# EAGLE design lcmeter (EAGLE 6.4)
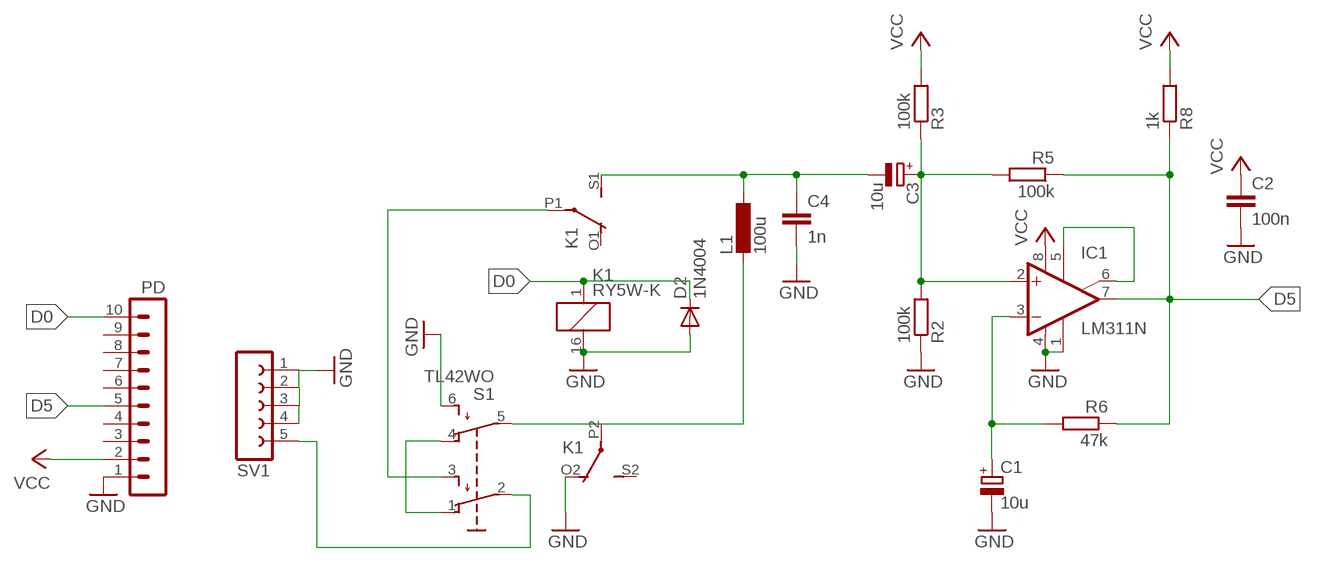
[diagram p0: schematic, sheet 1]

## Parts
C1  10u  CPOL-EUE2.5-6  [E2,5-6]
C2  100n  C-EU025-024X044  [C025-024X044]
C3  10u  CPOL-EUTT5D7  [TT5D7]
C4  1n  C-EU050-025X075  [C050-025X075]
D2  1N4004  1N4148DO35-7  [DO35-7]
IC1  LM311N  [DIL08]
K1  RY5W-K  351  [351]
L1  100u  L-EU0204/7  [0204/7]
PD  MA10-1W  [MA10-1W]
R2  100k  R-EU_0207/10  [0207/10]
R3  100k  R-EU_0204/7  [0204/7]
R5  100k  R-EU_0204/7  [0204/7]
R6  47k  R-EU_0204/5  [0204/5]
R8  1k  R-EU_0204/7  [0204/7]
S1  TL42WO  [TL4XWO]
SV1  FE05W  [FE05W]

## Nets
D0: D2.C K1.1 PD.10
D5: IC1.7(OUT) PD.5 R5.1 R6.1 R8.1
GND: C1.- C2.2 C4.2 D2.A IC1.1(GND) IC1.4(V-) K1.16 K1.O2(3:O) PD.1 R2.1 S1.6(S1) SV1.1 SV1.2 SV1.3 SV1.4
N$2: IC1.5(ON) IC1.6(ON/STR)
N$4: C3.+ IC1.2(+IN) R2.2 R3.1 R5.2
N$5: C1.+ IC1.3(-IN) R6.2
N$7: S1.1(O) S1.4(O1)
N$9: K1.P2(3:P) L1.2 S1.5(P1)
N$10: C3.- C4.1 K1.S1(2:S) L1.1
N$12: S1.2(P) SV1.5
N$13: K1.P1(2:P) S1.3(S)
VCC: C2.1 IC1.8(V+) PD.2 R3.2 R8.2
Unconnected: K1.O1(2:O) K1.S2(3:S) PD.3 PD.4 PD.6 PD.7 PD.8 PD.9

## Library data of the parts
C1 C3 = rcl:CPOL-EU: POLARIZED CAPACITOR, European symbol
C2 C4 = rcl:C-EU: CAPACITOR, European symbol
D2 = diode:1N4148: DIODE high speed (Philips)
IC1 = linear:LM311: COMPARATOR
K1 = relay:351: RELAY 2 x switch, Omron; OC_FARNELL: unknown; OC_NEWARK: unknown
L1 = rcl:L-EU: INDUCTOR, European symbol
PD = con-lstb:MA10-1W: PIN HEADER
R2 R3 R5 R6 R8 = rcl:R-EU_: RESISTOR, European symbol
S1 = switch:TL42WO: TINY SWITCH ON - MOM Source: http://www2.produktinfo.conrad.com/datenblaetter/700000-724999/705152-da-01-de-Subminiaturschalter_TL_36WO.pdf
SV1 = con-lsta:FE05W: FEMALE HEADER; OC_FARNELL: unknown; OC_NEWARK: unknown

## Board
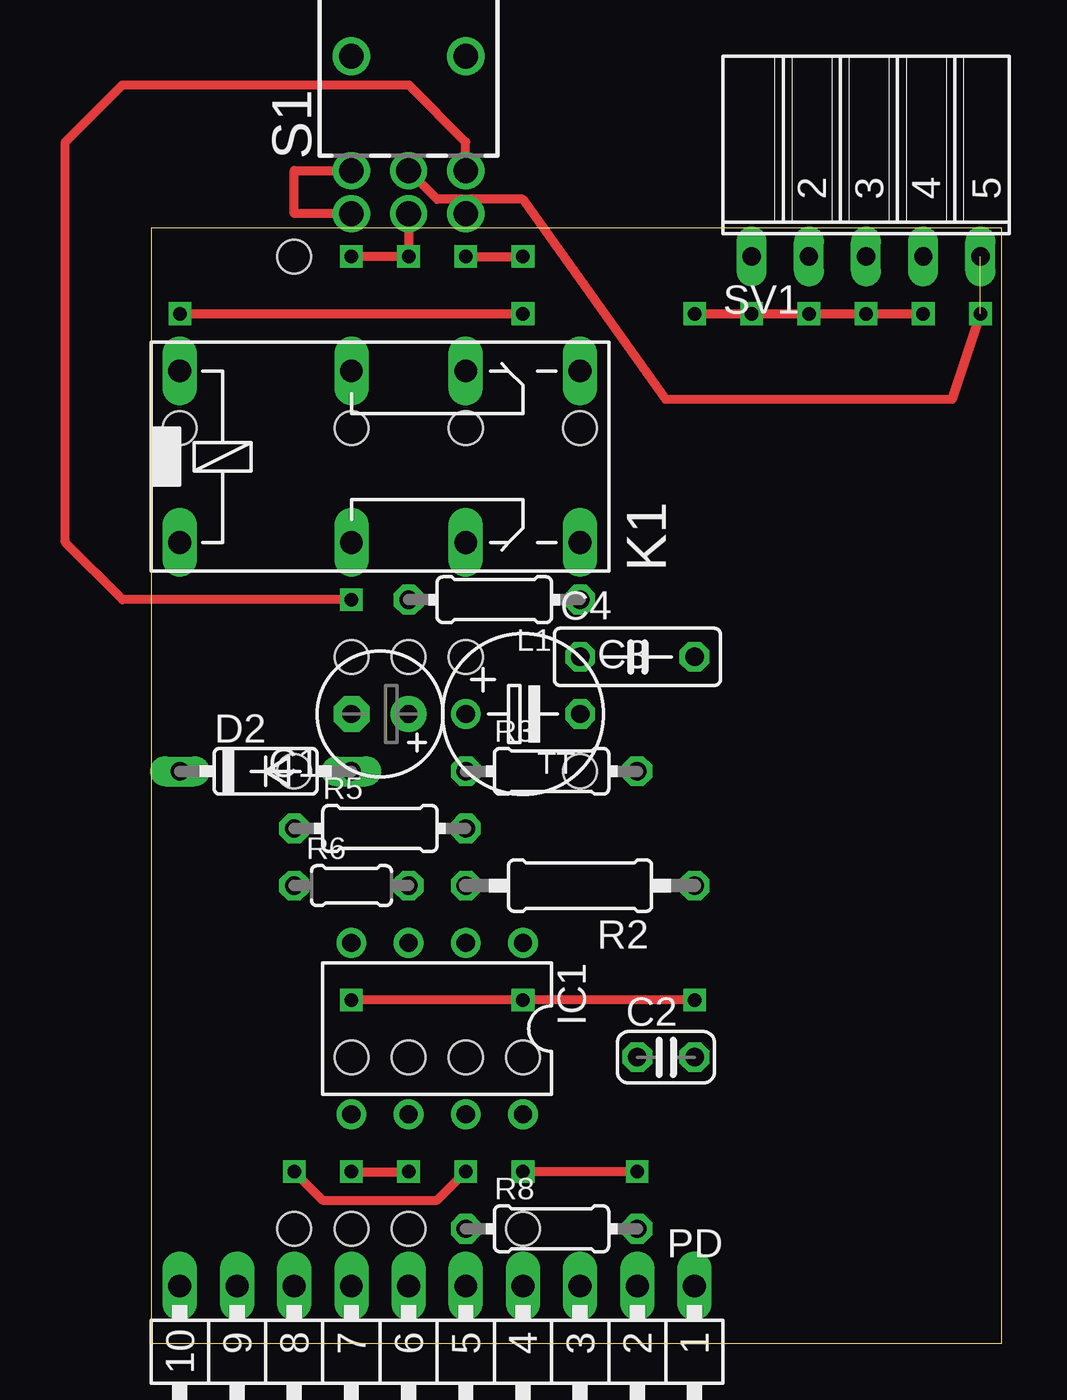
[diagram p1: board, top side]
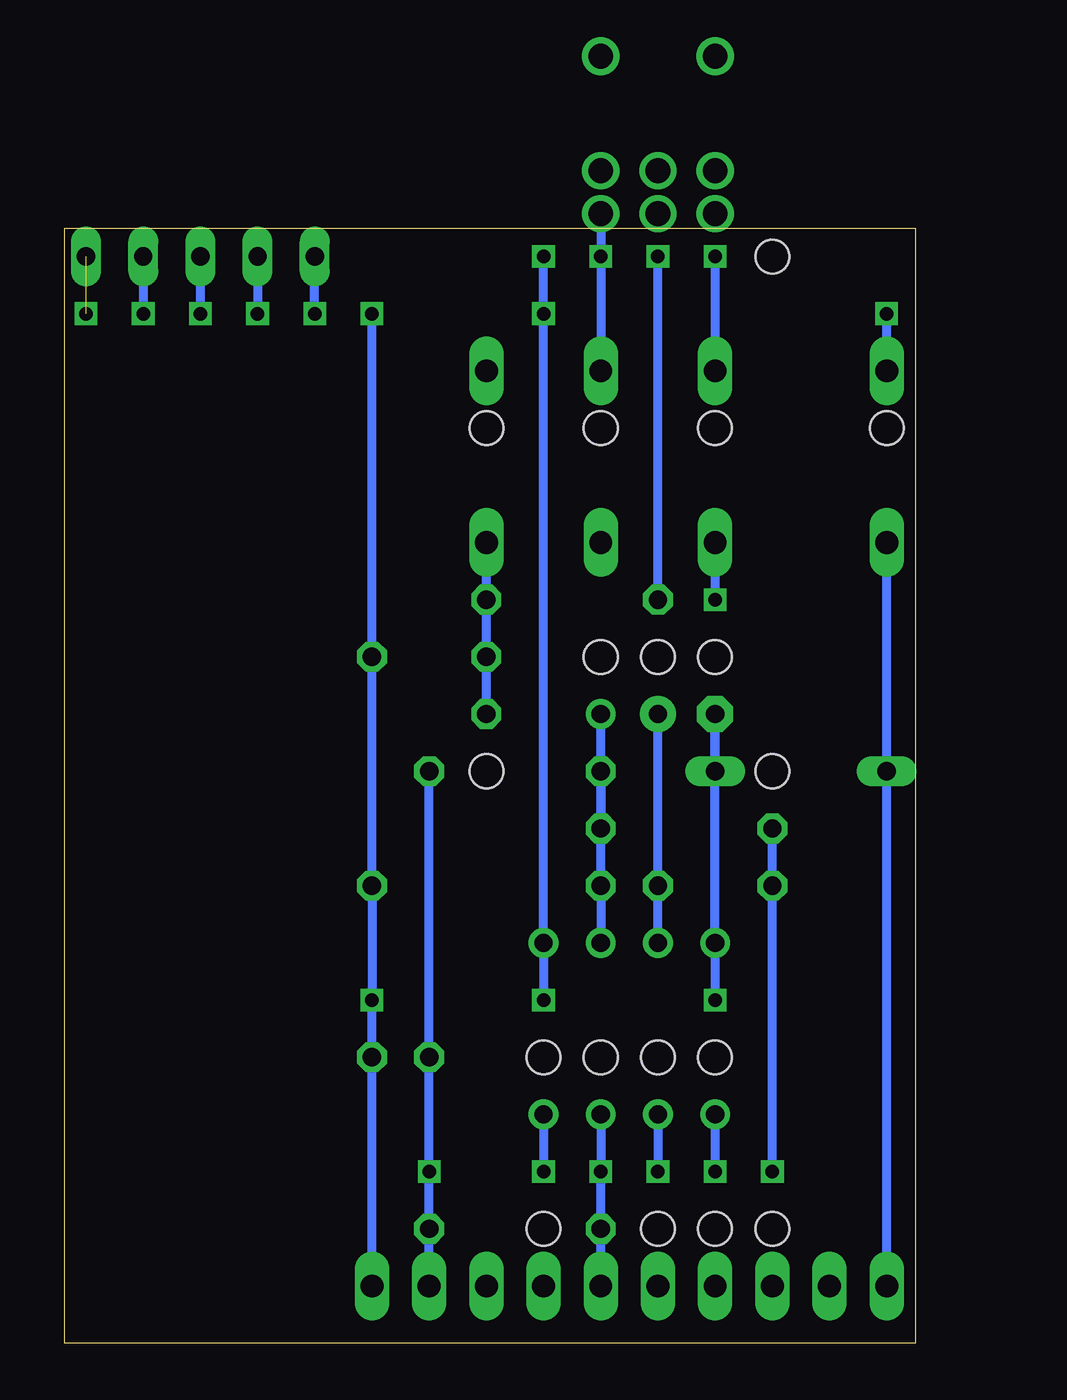
[diagram p2: board, bottom side, seen from below]

Size 37.77 x 49.52 mm. Coordinates in mm from the lower left corner, seen from the top.
Outline: 0,0 37.77,0 37.77,49.52 0,49.52 0,0
Copper layers (1*16): Top 0.035mm / dielectric 1.5mm / Bottom 0.035mm
Design rules "default": minimum track width 10mil, minimum drill 24mil, track to track 8mil, track to pad 8mil, pad to pad 8mil, via to via 8mil, smd to smd 8mil, copper to edge 40mil, drill to drill 8mil, minimum pad ring 10mil, minimum via ring 8mil, stop-mask expansion 4mil, vias tented up to drill 0mil, thermal gap 10mil
Holes 1.5 mm at 6.35,5.08 8.89,5.08 11.43,5.08 19.05,40.64 13.97,40.64 8.89,40.64 1.27,40.64 16.51,5.08 8.89,12.7 11.43,12.7 13.97,12.7 16.51,12.7 19.05,25.4 11.43,30.48 8.89,30.48 6.35,25.4 13.97,30.48 6.35,48.26

### Footprints (pad centres in the part's own frame; a part is rotated, then mirrored left to right if it is on the bottom)
E2,5-6 = drill 0.813 pad 1.6: + -1.27,0 | drill 0.813 pad 1.6 octagon: - 1.27,0
C025-024X044 = drill 0.813 octagon: 1 -1.27,0; 2 1.27,0
TT5D7 = drill 0.813: + -2.54,0 | drill 0.813 octagon: - 2.54,0
C050-025X075 = drill 0.813 octagon: 1 -2.54,0; 2 2.54,0
DO35-7 = drill 0.813 long: A 3.81,0; C -3.81,0
DIL08 = drill 0.813 pad 1.27: 1 -3.81,-3.81; 2 -1.27,-3.81; 3 1.27,-3.81; 4 3.81,-3.81; 5 3.81,3.81; 6 1.27,3.81; 7 -1.27,3.81; 8 -3.81,3.81
351 = drill 1.016 long: 1 -3.81,-3.81; 16 -3.81,3.81; O1 8.89,-3.81; O2 8.89,3.81; P1 3.81,-3.81; P2 3.81,3.81; S1 13.97,-3.81; S2 13.97,3.81
0204/7 = drill 0.813 octagon: 1 -3.81,0; 2 3.81,0
MA10-1W = drill 1.016 long: 1 -11.43,0; 2 -8.89,0; 3 -6.35,0; 4 -3.81,0; 5 -1.27,0; 6 1.27,0; 7 3.81,0; 8 6.35,0; 9 8.89,0; 10 11.43,0
0207/10 = drill 0.813 octagon: 1 -5.08,0; 2 5.08,0
0204/5 = drill 0.813 octagon: 1 -2.54,0; 2 2.54,0
TL4XWO = drill 1.1 pad 1.422: 1 -2.54,-5.08; 2 0,-5.08; 3 2.54,-5.08; 4 -2.54,-6.985; 5 0,-6.985; 6 2.54,-6.985 | drill 1.1 pad 1.676: M1 -2.54,0; M2 2.54,0
FE05W = drill 0.813 long: 1 -5.08,0; 2 -2.54,0; 3 0,0; 4 2.54,0; 5 5.08,0

### Placement (x,y rotation side)
C1  10.16,27.94 180 top
C2  22.86,12.7 0 top
C3  16.51,27.94 0 top
C4  21.59,30.48 0 top
D2  5.08,25.4 0 top
IC1  12.7,13.97 180 top
K1  5.08,39.37 0 top
L1  15.24,33.02 180 top
PD  12.7,2.54 180 top
R2  19.05,20.32 180 top
R3  17.78,25.4 0 top
R5  10.16,22.86 0 top
R6  8.89,20.32 0 top
R8  17.78,5.08 0 top
S1  11.43,57.15 0 top
SV1  31.75,48.26 0 top

### Tracks (layer width: path | path; a pad name or v marks a point on that pad's centre or on a via)
D0
  Bottom 0.406: PD.10 D2.C K1.1
D5  (via drill 0.6)
  Top 0.406: v6.35,7.62 7.62,6.35 12.7,6.35 v13.97,7.62
  Bottom 0.406: IC1.7 v13.97,7.62 R8.1 PD.5 | v6.35,7.62 R6.1 R5.1
GND  (via drill 0.6)
  Top 0.406: v24.13,15.24 v16.51,15.24 v8.89,15.24 | v13.97,48.26 v16.51,48.26 | v1.27,45.72 v16.51,45.72 | v24.13,45.72 v26.67,45.72 v29.21,45.72 v31.75,45.72 v34.29,45.72
  Bottom 0.406: PD.1 C2.2 v24.13,15.24 R2.1 C4.2 v24.13,45.72 | v16.51,15.24 IC1.1 v16.51,45.72 v16.51,48.26 | v8.89,15.24 IC1.4 C1.- D2.A | S1.6 v13.97,48.26 K1.O2 | K1.16 v1.27,45.72 | SV1.2 v29.21,45.72 | SV1.4 v34.29,45.72 | v31.75,45.72 SV1.3 | v26.67,45.72 SV1.1
N$2  (via drill 0.6)
  Top 0.406: v8.89,7.62 v11.43,7.62
  Bottom 0.406: IC1.5 v8.89,7.62 | IC1.6 v11.43,7.62
N$4
  Bottom 0.406: R5.2 R2.2 IC1.2 | R5.2 C3.+ | R3.1 R5.2
N$5
  Bottom 0.406: IC1.3 R6.2 C1.+
N$7
  Top 0.406: S1.4 6.35,50.16 6.35,52.07 S1.1
N$9  (via drill 0.6)
  Top 0.406: S1.5 v11.43,48.26 v8.89,48.26
  Bottom 0.406: v8.89,48.26 K1.P2 | L1.2 v11.43,48.26
N$10
  Bottom 0.406: C3.- C4.1 L1.1 K1.S1
N$12  (via drill 0.6)  (1 unrouted)
  Top 0.406: v36.83,45.72 35.56,41.91 22.86,41.91 16.51,50.8 12.7,50.8 S1.2
N$13  (via drill 0.6)
  Top 0.406: v8.89,33.02 -1.27,33.02 -3.81,35.56 -3.81,53.34 -1.27,55.88 11.43,55.88 13.97,53.34 S1.3
  Bottom 0.406: K1.P1 v8.89,33.02
VCC  (via drill 0.6)
  Top 0.406: v21.59,7.62 v16.51,7.62
  Bottom 0.406: PD.2 R8.2 v21.59,7.62 C2.1 R3.2 | IC1.8 v16.51,7.62

### Text on the board
doc_purple: LC METER